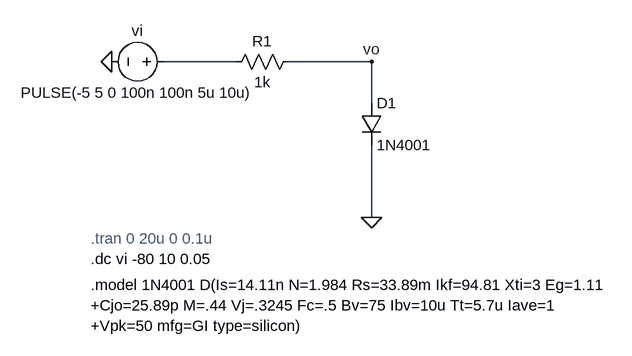
[diagram p0: schematic Lab6p1.asc]
Lab6p1.asc, the LTspice schematic file:
Version 4
SHEET 1 920 680
WIRE 224 16 112 16
WIRE 432 16 304 16
WIRE 432 80 432 16
WIRE 432 256 432 144
FLAG 432 256 0
FLAG 32 16 0
FLAG 432 16 vo
SYMBOL diode 416 80 R0
SYMATTR InstName D1
SYMATTR Value 1N4001
SYMBOL res 320 0 R90
WINDOW 0 0 56 VBottom 2
WINDOW 3 32 56 VTop 2
SYMATTR InstName R1
SYMATTR Value 1k
SYMBOL voltage 128 16 R90
WINDOW 0 -32 56 VBottom 2
WINDOW 3 32 56 VTop 2
WINDOW 123 0 0 Left 0
WINDOW 39 0 0 Left 0
SYMATTR InstName vi
SYMATTR Value PULSE(-5 5 0 100n 100n 5u 10u)
TEXT 0 360 Left 2 !.model 1N4001 D(Is=14.11n N=1.984 Rs=33.89m Ikf=94.81 Xti=3 Eg=1.11\n+Cjo=25.89p M=.44 Vj=.3245 Fc=.5 Bv=75 Ibv=10u Tt=5.7u Iave=1\n+Vpk=50 mfg=GI type=silicon)
TEXT 0 320 Left 2 !.dc vi -80 10 0.05
TEXT 0 288 Left 2 ;.tran 0 20u 0 0.1u

The netlist it stands for:
* Lab6p1.asc
D1 vo 0 1N4001
R1 vo N001 1k
vi N001 0 PULSE(-5 5 0 100n 100n 5u 10u)
.model D D
.lib standard.dio
.model 1N4001 D(Is=14.11n N=1.984 Rs=33.89m Ikf=94.81 Xti=3 Eg=1.11
+Cjo=25.89p M=.44 Vj=.3245 Fc=.5 Bv=75 Ibv=10u Tt=5.7u Iave=1
+Vpk=50 mfg=GI type=silicon)
.dc vi -80 10 0.05
* .tran 0 20u 0 0.1u
.backanno
.end